# Altium project AM438x_EPOS_EVM_PMconnect.PrjPCB
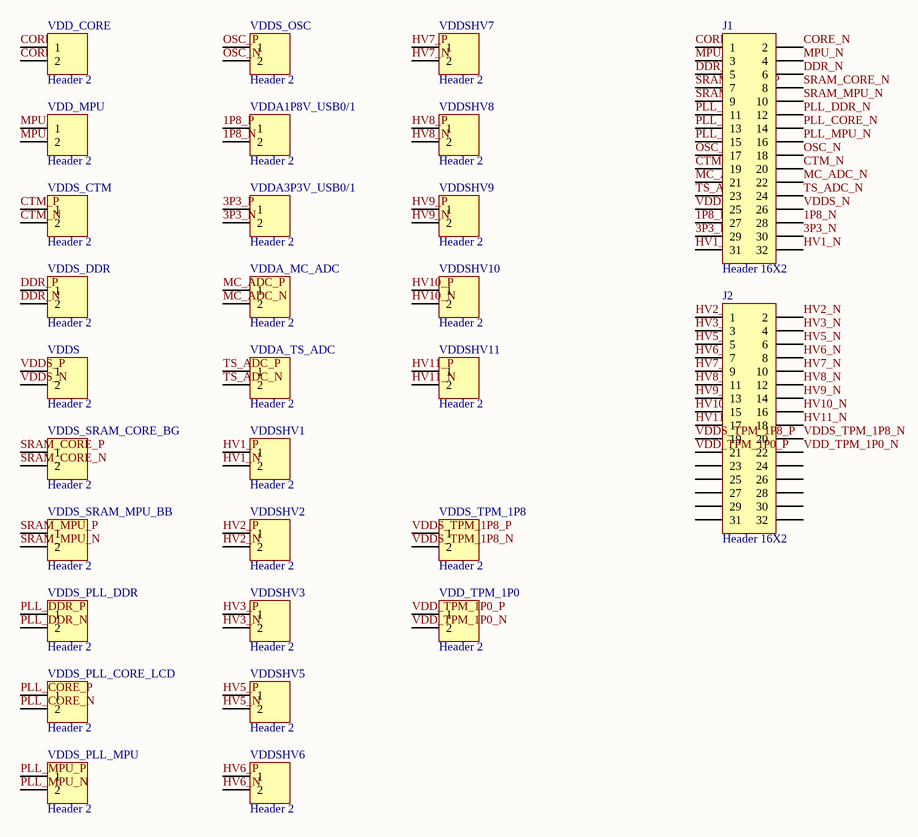
[diagram p0: AM438x_EPOS_EVM_PMconnect.SchDoc]
1 sheet, 29 parts. Net scope: global (net labels, ports and power ports of the same name join across sheets).
Board file: AM438x_EPOS_EVM_PMconnect.PcbDoc

## Sheet AM438x_EPOS_EVM_PMconnect.SchDoc
size A

### Parts
J1  Header 16X2  [HDR2X16]
J2  Header 16X2  [HDR2X16]
VDD_CORE  Header 2  [HDR1X2]
VDD_MPU  Header 2  [HDR1X2]
VDD_TPM_1P0  Header 2  [HDR1X2]
VDDA1P8V_USB0/1  Header 2  [HDR1X2]
VDDA3P3V_USB0/1  Header 2  [HDR1X2]
VDDA_MC_ADC  Header 2  [HDR1X2]
VDDA_TS_ADC  Header 2  [HDR1X2]
VDDS  Header 2  [HDR1X2]
VDDS_CTM  Header 2  [HDR1X2]
VDDS_DDR  Header 2  [HDR1X2]
VDDS_OSC  Header 2  [HDR1X2]
VDDS_PLL_CORE_LCD  Header 2  [HDR1X2]
VDDS_PLL_DDR  Header 2  [HDR1X2]
VDDS_PLL_MPU  Header 2  [HDR1X2]
VDDS_SRAM_CORE_BG  Header 2  [HDR1X2]
VDDS_SRAM_MPU_BB  Header 2  [HDR1X2]
VDDS_TPM_1P8  Header 2  [HDR1X2]
VDDSHV1  Header 2  [HDR1X2]
VDDSHV2  Header 2  [HDR1X2]
VDDSHV3  Header 2  [HDR1X2]
VDDSHV5  Header 2  [HDR1X2]
VDDSHV6  Header 2  [HDR1X2]
VDDSHV7  Header 2  [HDR1X2]
VDDSHV8  Header 2  [HDR1X2]
VDDSHV9  Header 2  [HDR1X2]
VDDSHV10  Header 2  [HDR1X2]
VDDSHV11  Header 2  [HDR1X2]

### Nets
1P8_N: J1.28 VDDA1P8V_USB0/1.2
1P8_P: J1.27 VDDA1P8V_USB0/1.1
3P3_N: J1.30 VDDA3P3V_USB0/1.2
3P3_P: J1.29 VDDA3P3V_USB0/1.1
CORE_N: J1.2 VDD_CORE.2
CORE_P: J1.1 VDD_CORE.1
CTM_N: J1.20 VDDS_CTM.2
CTM_P: J1.19 VDDS_CTM.1
DDR_N: J1.6 VDDS_DDR.2
DDR_P: J1.5 VDDS_DDR.1
HV1_N: J1.32 VDDSHV1.2
HV1_P: J1.31 VDDSHV1.1
HV2_N: J2.2 VDDSHV2.2
HV2_P: J2.1 VDDSHV2.1
HV3_N: J2.4 VDDSHV3.2
HV3_P: J2.3 VDDSHV3.1
HV5_N: J2.6 VDDSHV5.2
HV5_P: J2.5 VDDSHV5.1
HV6_N: J2.8 VDDSHV6.2
HV6_P: J2.7 VDDSHV6.1
HV7_N: J2.10 VDDSHV7.2
HV7_P: J2.9 VDDSHV7.1
HV8_N: J2.12 VDDSHV8.2
HV8_P: J2.11 VDDSHV8.1
HV9_N: J2.14 VDDSHV9.2
HV9_P: J2.13 VDDSHV9.1
HV10_N: J2.16 VDDSHV10.2
HV10_P: J2.15 VDDSHV10.1
HV11_N: J2.18 VDDSHV11.2
HV11_P: J2.17 VDDSHV11.1
MC_ADC_N: J1.22 VDDA_MC_ADC.2
MC_ADC_P: J1.21 VDDA_MC_ADC.1
MPU_N: J1.4 VDD_MPU.2
MPU_P: J1.3 VDD_MPU.1
OSC_N: J1.18 VDDS_OSC.2
OSC_P: J1.17 VDDS_OSC.1
PLL_CORE_N: J1.14 VDDS_PLL_CORE_LCD.2
PLL_CORE_P: J1.13 VDDS_PLL_CORE_LCD.1
PLL_DDR_N: J1.12 VDDS_PLL_DDR.2
PLL_DDR_P: J1.11 VDDS_PLL_DDR.1
PLL_MPU_N: J1.16 VDDS_PLL_MPU.2
PLL_MPU_P: J1.15 VDDS_PLL_MPU.1
SRAM_CORE_N: J1.8 VDDS_SRAM_CORE_BG.2
SRAM_CORE_P: J1.7 VDDS_SRAM_CORE_BG.1
SRAM_MPU_N: J1.10 VDDS_SRAM_MPU_BB.2
SRAM_MPU_P: J1.9 VDDS_SRAM_MPU_BB.1
TS_ADC_N: J1.24 VDDA_TS_ADC.2
TS_ADC_P: J1.23 VDDA_TS_ADC.1
VDD_TPM_1P0_N: J2.22 VDD_TPM_1P0.2
VDD_TPM_1P0_P: J2.21 VDD_TPM_1P0.1
VDDS_N: J1.26 VDDS.2
VDDS_P: J1.25 VDDS.1
VDDS_TPM_1P8_N: J2.20 VDDS_TPM_1P8.2
VDDS_TPM_1P8_P: J2.19 VDDS_TPM_1P8.1

Not connected (* = marked no-connect by the designer): J2 23 24 25 26 27 28 29 30 31 32

### Library data of the parts
J1 J2 = Header 16X2: Header, 16-Pin, Dual row; LatestRevisionDate: 17-Jul-2002; LatestRevisionNote: Re-released for DXP Platform.; Publisher: Altium Limited
VDD_CORE VDD_MPU VDD_TPM_1P0 VDDA1P8V_USB0/1 VDDA3P3V_USB0/1 VDDA_MC_ADC VDDA_TS_ADC VDDS VDDS_CTM VDDS_DDR VDDS_OSC VDDS_PLL_CORE_LCD VDDS_PLL_DDR VDDS_PLL_MPU VDDS_SRAM_CORE_BG VDDS_SRAM_MPU_BB VDDS_TPM_1P8 VDDSHV1-VDDSHV3 VDDSHV5-VDDSHV11 = Header 2: Header, 2-Pin; LatestRevisionDate: 17-Jul-2002; LatestRevisionNote: Re-released for DXP Platform.; Publisher: Altium Limited